# Altium schematic sheet ButtonCircuit.SchDoc
size A; SheetNumber: 9; SheetTotal: 9
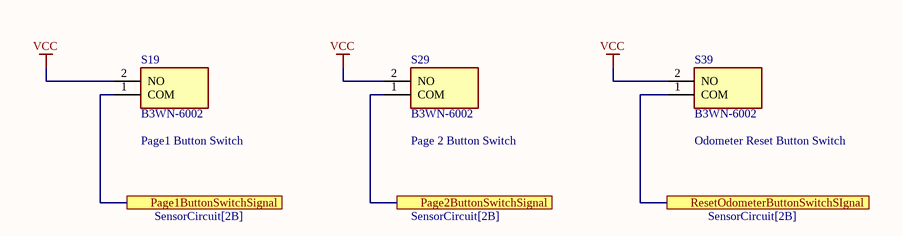
[diagram p0: ButtonCircuit.SchDoc]

## Parts
S19  B3WN-6002  [B3WN6002]
S29  B3WN-6002  [B3WN6002]
S39  B3WN-6002  [B3WN6002]

## Ports
Page1ButtonSwitchSignal (see SensorCircuit[2B]), Page2ButtonSwitchSignal (see SensorCircuit[2B]), ResetOdometerButtonSwitchSIgnal (see SensorCircuit[2B])

## Nets
VCC: S19.2(NO) S29.2(NO) S39.2(NO)
Page1ButtonSwitchSignal: S19.1(COM) ; port Page1ButtonSwitchSignal
Page2ButtonSwitchSignal: S29.1(COM) ; port Page2ButtonSwitchSignal
ResetOdometerButtonSwitchSIgnal: S39.1(COM) ; port ResetOdometerButtonSwitchSIgnal

## Notes on the sheet
- (near S19) Page1 Button Switch
- (near S29) Page 2 Button Switch
- (near S39) Odometer Reset Button Switch

## Library data of the parts
S19 S29 S39 = B3WN-6002: Switch; Manufacturer_Name: Omron Electronics; Datasheet Link: http://omronfs.omron.com/en_US/ecb/products/pdf/en-b3wn.pdf; Height: 13.2mm; Manufacturer_Part_Number: B3WN-6002; Mouser Part Number: 653-B3WN-6002; Mouser Price/Stock: https://www.mouser.co.uk/ProductDetail/Omron-Electronics/B3WN-6002?qs=CX134%252BdLMDH3t3DGk60Xxw%3D%3D; Arrow Part Number: B3WN-6002; Arrow Price/Stock: https://www.arrow.com/en/products/b3wn-6002/omron?region=europe